# Altium schematic sheet display.SchDoc
size A4; SheetNumber: 2; SheetTotal: 5
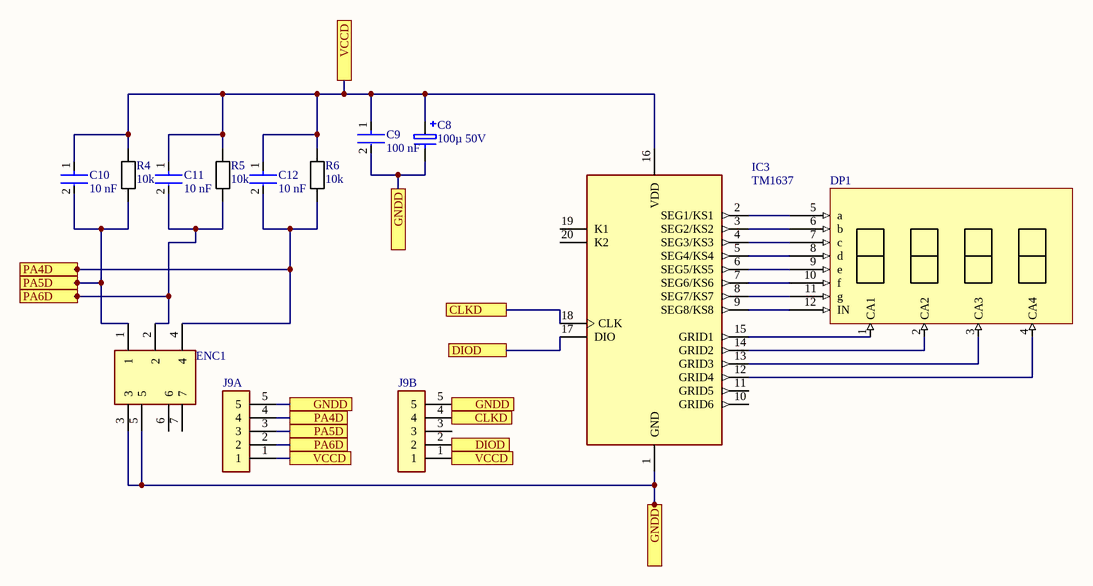
[diagram p0: display.SchDoc]

## Parts
C8  100µ 50V  [Elco 100uF 25V]
C9  100 nF  [0805]
C10  10 nF  [0805]
C11  10 nF  [0805]
C12  10 nF  [0805]
DP1  7segment  [DIP12(7segment)]  (value not drawn)
ENC1  PEC11R-4225F-S0024  [Encoder]  (value not drawn)
IC3  TM1637  [TM1637]
J9A  5-146280-5  [5 Pin Header]  (value not drawn)
J9B  5-146280-5  [5 Pin Header]  (value not drawn)
R4  10k  [weerstand]
R5  10k  [weerstand]
R6  10k  [weerstand]

## Ports
CLKD (see display[2B]), DIOD (see display[2B]), DIOD (see display[2C]), GNDD (see display[2B]), GNDD (see display[2B], display[3C]), PA4D (see display[1B]), PA4D (see display[2B]), PA5D (see display[1B]), PA5D (see display[2B]), PA6D (see display[1B]), PA6D (see display[2C]), VCCD (see display[2A], display[2C]), VCCD (see display[2C])

## Nets
CLKD: IC3.18(CLK) J9B.4 ; port CLKD
DIOD: IC3.17(DIO) J9B.2 ; port DIOD
GNDD: C8.2 C9.2 ENC1.3 ENC1.5 IC3.1(GND) J9A.5 J9B.5 ; port GNDD
PA4D: C12.2 ENC1.4 J9A.4 R6.1 ; port PA4D
PA5D: C10.2 ENC1.1 J9A.3 R4.1 ; port PA5D
PA6D: C11.2 ENC1.2 J9A.2 R5.1 ; port PA6D
VCCD: C8.1 C9.1 C10.1 C11.1 C12.1 IC3.16(VDD) J9A.1 J9B.1 R4.2 R5.2 R6.2 ; port VCCD
NetDP1_1: DP1.1(CA1) IC3.15(GRID1)
NetDP1_2: DP1.2(CA2) IC3.14(GRID2)
NetDP1_3: DP1.3(CA3) IC3.13(GRID3)
NetDP1_4: DP1.4(CA4) IC3.12(GRID4)
NetDP1_5: DP1.5(a) IC3.2(SEG1/KS1)
NetDP1_6: DP1.6(b) IC3.3(SEG2/KS2)
NetDP1_7: DP1.7(c) IC3.4(SEG3/KS3)
NetDP1_8: DP1.8(d) IC3.5(SEG4/KS4)
NetDP1_9: DP1.9(e) IC3.6(SEG5/KS5)
NetDP1_10: DP1.10(f) IC3.7(SEG6/KS6)
NetDP1_11: DP1.11(g) IC3.8(SEG7/KS7)
NetDP1_12: DP1.12(IN) IC3.9(SEG8/KS8)

Not connected (* = marked no-connect by the designer): ENC1 6 7; IC3 10(GRID6) 11(GRID5) 19(K1) 20(K2); J9B 3

## Library data of the parts
C8 = Condensator Elco: 100µ / 50V; Part Number: 02015A270JAT2A; Manufacturer: AVX Interconnect / Elco
C9-C12 = Condensator 0805: Chip Multilayer Ceramic Capacitors for General Purpose, 0805, 10uF, X5R, 15%, 10%, 25V; Length: 2mm; Depth: 1.25mm; Termination: SMD/SMT; Voltage: 25V; Height: 1.25mm; Material: Ceramic; Thickness: 0.053inch; Radiation Hardening: No; Min Operating Temperature: -55°C; Width: 0.049inch; Package Quantity: 1; Mount: Surface Mount; Dielectric: X5R; Packaging: Tape and Reel; Capacitance: 10uF; Voltage Rating (DC): 25V; Lead Free: Lead Free; Max Operating Temperature: 85°C; Case Code (Imperial): 0805; Case/Package: 0805; Tolerance: 10%; Voltage Rating: 25V; Case Code (Metric): 2012
ENC1 = Encoder: Undefined or Miscellaneous; Manufacturer_Name: Bourns; Datasheet Link: https://componentsearchengine.com//PEC11R-4225F-S0024.pdf; Mouser2 Part Number: 652-PEC11R-4225F-S24; Mouser2 Price/Stock: https://www.mouser.com/Search/Refine.aspx?Keyword=652-PEC11R-4225F-S24; Manufacturer_Part_Number: PEC11R-4225F-S0024
IC3 = TM1637: LED Drive Control Special Circuit; MF: Titan Micro Electronics; Package: Package; Availability: Not in stock; SnapEDA_Link: https://www.snapeda.com/parts/TM1637/Titan+Micro+Electronics/view-part/?ref=snap; MP: TM1637; Check_prices: https://www.snapeda.com/parts/TM1637/Titan+Micro+Electronics/view-part/?ref=eda; Value: *; Price: None
J9A J9B = 5 Pin Header: Connector 5-146280-5; Manufacturer_Name: TE Connectivity; Datasheet Link: https://componentsearchengine.com//5-146280-5.pdf; Height: 8.21mm; Mouser2 Part Number: 571-5-146280-5; Mouser2 Price/Stock: https://www.mouser.com/Search/Refine.aspx?Keyword=571-5-146280-5; Manufacturer_Part_Number: 5-146280-5
R4-R6 = weerstand: Manufacturer: Vishay Dale; Part Number: CRCW08050000Z0EA